# EAGLE design Heizstabsteuerung (EAGLE 9.6.2)
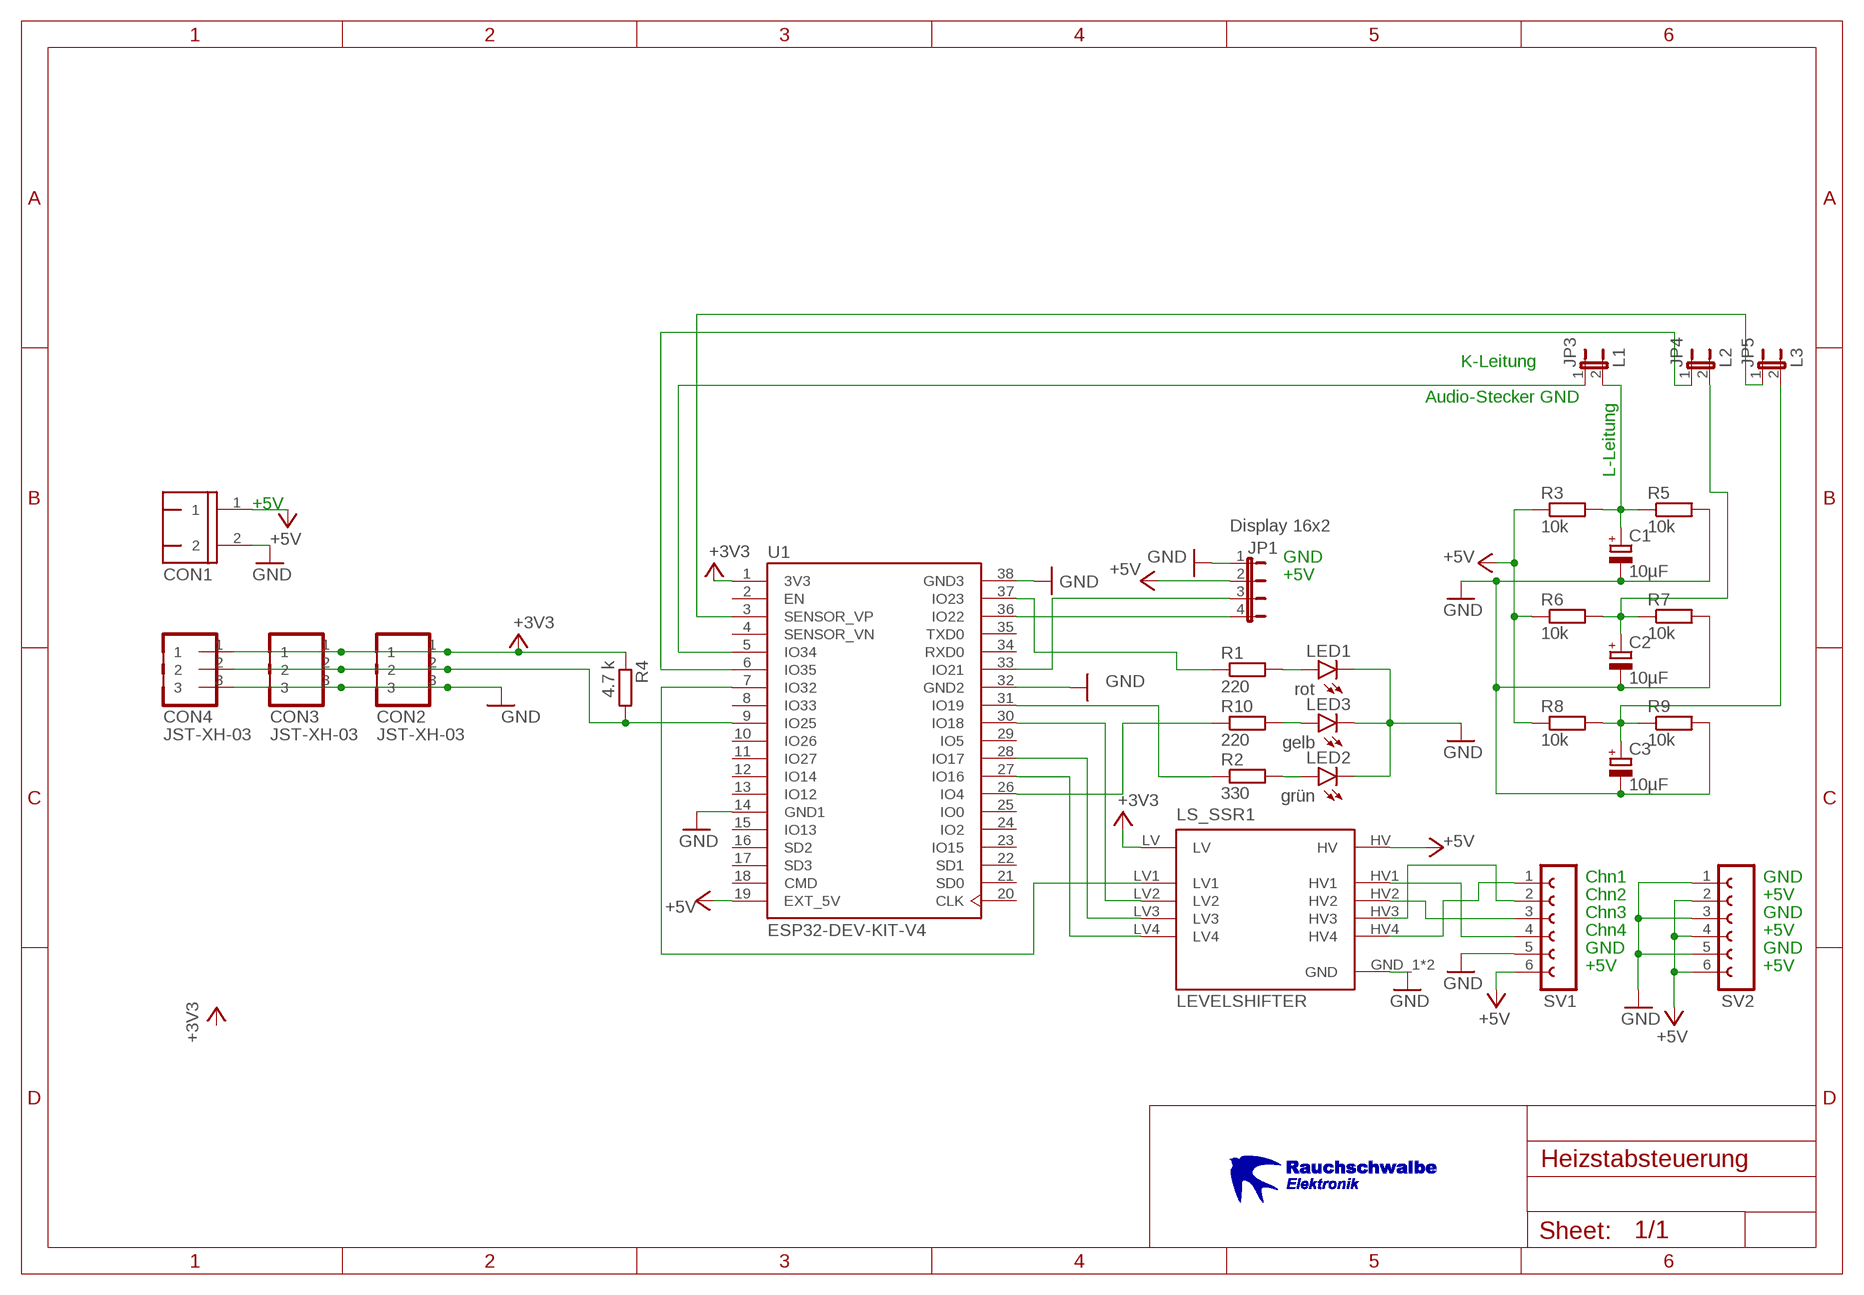
[diagram p0: schematic, sheet 1]

## Parts
C1  10µF  CPOL-EUE2.5-5  [E2,5-5]
C2  10µF  CPOL-EUE2.5-5  [E2,5-5]
C3  10µF  CPOL-EUE2.5-5  [E2,5-5]
CON1  WAGO-500-2  [WAGO-500-2]
CON2  JST-XH-03  [JST-XH-03]
CON3  JST-XH-03  [JST-XH-03]
CON4  JST-XH-03  [JST-XH-03]
JP1  Display 16x2  JP4E  [JP4]
JP3  L1  JP1E  [JP1]
JP4  L2  JP1E  [JP1]
JP5  L3  JP1E  [JP1]
LED1  rot  LED3MM  [LED3MM]
LED2  grün  LED3MM  [LED3MM]
LED3  gelb  LED3MM  [LED3MM]
LS_SSR1  LEVELSHIFTER  [LEVELSHIFTER]
R1  220  R_10MM0207/10  [0207/10]
R2  330  R_10MM0207/10  [0207/10]
R3  10k  R_10MM0207/10  [0207/10]
R4  4.7 k  R_10MM0207/10  [0207/10]
R5  10k  R_10MM0207/10  [0207/10]
R6  10k  R_10MM0207/10  [0207/10]
R7  10k  R_10MM0207/10  [0207/10]
R8  10k  R_10MM0207/10  [0207/10]
R9  10k  R_10MM0207/10  [0207/10]
R10  220  R_10MM0207/10  [0207/10]
SV1  FE06-1  [FE06]
SV2  FE06-1  [FE06]
U1  ESP32-DEV-KIT-V4  [ESP32-DEV-KIT-V4]
U$1  LOGO_RAUCHSCHWALBE  [LOGO_RAUCHSCHWALBE]

## Nets
+3V3 [Versorgung]: CON2.1 CON3.1 CON4.1 LS_SSR1.LV R4.1 U1.1(3V3)
+5V [Versorgung]: CON1.1 JP1.2 LS_SSR1.HV R3.1 R6.1 R8.1 SV1.6 SV2.2 SV2.4 SV2.6 U1.19(EXT_5V)
GND [Versorgung]: C1.- C2.- C3.- CON1.2 CON2.3 CON3.3 CON4.3 JP1.1 LED1.K(C) LED2.K(C) LED3.K(C) LS_SSR1.GND_1(GND) LS_SSR1.GND_2(GND) R5.2 R7.2 R9.2 SV1.5 SV2.1 SV2.3 SV2.5 U1.14(GND1) U1.32(GND2) U1.38(GND3)
N$1 [Data]: R1.1 U1.37(IO23)
N$2 [Data]: C1.+ JP3.2 R3.2 R5.1
N$3 [Data]: LED3.A R10.2
N$4 [Data]: JP1.3 U1.33(IO21)
N$5 [Data]: JP1.4 U1.36(IO22)
N$6 [Data]: R2.1 U1.31(IO19)
N$7 [Data]: LED1.A R1.2
N$8 [Data]: LED2.A R2.2
N$9 [Data]: LS_SSR1.HV4 SV1.1
N$10 [Data]: LS_SSR1.LV1 U1.7(IO32)
N$11 [Data]: CON2.2 CON3.2 CON4.2 R4.2 U1.9(IO25)
N$12 [Data]: JP3.1 U1.5(IO34)
N$14 [Data]: LS_SSR1.LV4 U1.27(IO16)
N$15 [Data]: LS_SSR1.LV3 U1.28(IO17)
N$16 [Data]: LS_SSR1.LV2 U1.30(IO18)
N$17 [Data]: R10.1 U1.26(IO4)
N$18 [Data]: LS_SSR1.HV1 SV1.4
N$19 [Data]: LS_SSR1.HV2 SV1.3
N$20 [Data]: LS_SSR1.HV3 SV1.2
N$21 [Data]: JP4.1 U1.6(IO35)
N$22 [Data]: JP5.1 U1.3(SENSOR_VP)
N$27 [Data]: C2.+ JP4.2 R6.2 R7.1
N$28 [Data]: C3.+ JP5.2 R8.2 R9.1
Unconnected: U1.2(EN) U1.4(SENSOR_VN) U1.8(IO33) U1.10(IO26) U1.11(IO27) U1.12(IO14) U1.13(IO12) U1.15(IO13) U1.16(SD2) U1.17(SD3) U1.18(CMD) U1.20(CLK) U1.21(SD0) U1.22(SD1) U1.23(IO15) U1.24(IO2) U1.25(IO0) U1.29(IO5) U1.34(RXD0) U1.35(TXD0)

## Notes on the sheet
- K-Leitung
- Audio-Stecker GND | L-Leitung
- +5V
- GND
- +5V
- Chn1 | GND
- Chn2 | +5V
- Chn3 | GND
- Chn4 | +5V
- GND | GND
- +5V | +5V

## Library data of the parts
C1-C3 = Heizstabsteuerung:CPOL-EU: POLARIZED CAPACITOR, European symbol; SPICEPREFIX: C
CON1 = Heizstabsteuerung:WAGO-500-2: WAGO SCREW CLAMP; MPN: 237-102; OC_FARNELL: unknown; OC_NEWARK: 70K9898
CON2-CON4 = Heizstabsteuerung:JST-XH-03
JP1 = jumper:JP4E: JUMPER
JP3-JP5 = jumper:JP1E: JUMPER
LED1-LED3 = Heizstabsteuerung:LED: LED OSRAM: - CHIPLED LG R971, LG N971, LY N971, LG Q971, LY Q971, LO R971, LY R971 LH N974, LH R974 LS Q976, LO Q976, LY Q976 LO Q996 - Hyper CHIPLED LW Q18S LB Q993, LB Q99A, LB R99A - SideLED LS A670, LO A670, LY A670, LG A670, LP A670 LB A673, LV A673, LT A673, LW A673 LH A674 LY A675 LS A676, LA A676, LO A676, LY A676, LW A676 LS A679, LY A679, LG A679 - Hyper Micro SIDELED® LS Y876, LA Y876, LO Y876, LY Y876 LT Y87S - SmartLED LW L88C, LW L88S LB L89C, LB L89S, LG L890 LS L89K, LO L89K, LY L89K LS L896, LA L896, LO L896, LY L896 - TOPLED LS T670, LO T670, LY T670, LG T670, LP T670 LSG T670, LSP T670, LSY T670, LOP T670, LYG T670 LG T671, LOG T671, LSG T671 LB T673, LV T673, LT T673, LW T673 LH T674 LS T676, LA T676, LO T676, LY T676, LB T676, LH T676, LSB T676, LW T676 LB T67C, LV T67C, LT T67C, LS T67K, LO T67K, LY T67K, LW E67C LS E67B, LA E67B, LO E67B, LY E67B, LB E67C, LV E67C, LT E67C LW T67C LS T679, LY T679, LG T679 LS T770, LO T770, LY T770, LG T770, LP T770 LB T773, LV T773, LT T773, LW T773 LH T774 LS E675, LA E675, LY E675, LS T675 LS T776, LA T776, LO T776, LY T776, LB T776 LHGB T686 LT T68C, LB T68C - Hyper Mini TOPLED® LB M676 - Mini TOPLED Santana® LG M470 LS M47K, LO M47K, LY M47K Source: http://www.osram.convergy.de LUXEON: - LUMILED® LXK2-PW12-R00, LXK2-PW12-S00, LXK2-PW14-U00, LXK2-PW14-V00 LXK2-PM12-R00, LXK2-PM12-S00, LXK2-PM14-U00 LXK2-PE12-Q00, LXK2-PE12-R00, LXK2-PE12-S00, LXK2-PE14-T00, LXK2-PE14-U00 LXK2-PB12-K00, LXK2-PB12-L00, LXK2-PB12-M00, LXK2-PB14-N00, LXK2-PB14-P00, LXK2-PB14-Q00 LXK2-PR12-L00, LXK2-PR12-M00, LXK2-PR14-Q00, LXK2-PR14-R00 LXK2-PD12-Q00, LXK2-PD12-R00, LXK2-PD12-S00 LXK2-PH12-R00, LXK2-PH12-S00 LXK2-PL12-P00, LXK2-PL12-Q00, LXK2-PL12-R00 Source: www.luxeon.com KINGBRIGHT: KA-3528ASYC Source: www.kingbright.com
LS_SSR1 = Heizstabsteuerung:LEVELSHIFTER: Logic Level Converter - Bi-Direc Check availability <https://pricing.snapeda.com/parts/BOB-12009/SparkFun/view-part?ref=eda>; AVAILABILITY: In Stock; DESCRIPTION: BSS138 Logic-Level Translator Interface Evaluation Board; MF: SparkFun; MP: BOB-12009; PACKAGE: None; PRICE: None; PURCHASE-URL: https://pricing.snapeda.com/search?q=BOB-12009&ref=eda
R1-R10 = Heizstabsteuerung:R_10MM: RESISTOR, European symbol; SPICEPREFIX: R
SV1 SV2 = Heizstabsteuerung:FE06-1: FEMALE HEADER; OC_FARNELL: unknown; OC_NEWARK: unknown
U1 = Heizstabsteuerung:ESP32-DEV-KIT-V4: ESP32-DEVKITC Check availability <https://pricing.snapeda.com/parts/ESP32-DEVKITC/Espressif%20Systems/view-part?ref=eda>; AVAILABILITY: In Stock; CHECK_PRICES: https://www.snapeda.com/parts/ESP32-DEVKITC/Espressif+Systems/view-part/?ref=eda; DESCRIPTION: ESP32-WROOM-32UE series Transceiver; 802.11 b/g/n (Wi-Fi, WiFi, WLAN), Bluetooth ® Smart Ready 4.x Dual Mode Evaluation Board; MF: Espressif Systems; MP: ESP32-DEVKITC; PACKAGE: None; PRICE: None; SNAPEDA_LINK: https://www.snapeda.com/parts/ESP32-DEVKITC/Espressif+Systems/view-part/?ref=snap
U$1 = Heizstabsteuerung:LOGO_RAUCHSCHWALBE

## Net classes
1 Versorgung: width 0.762 mm, drill 0.8 mm, clearance 0.508 mm
2 Data: width 0.406 mm, drill 0.6 mm, clearance 0.254 mm

## Board
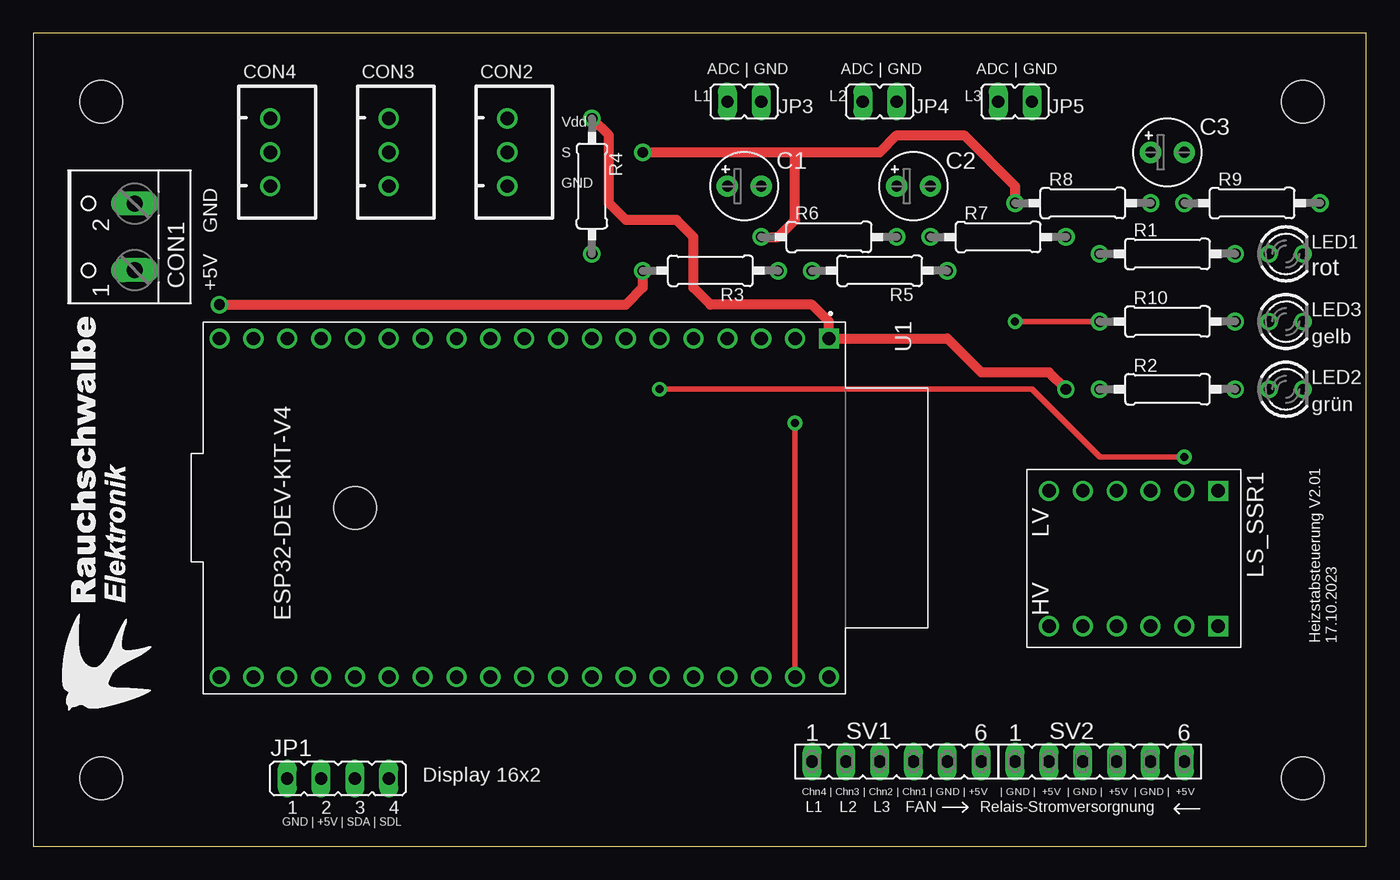
[diagram p1: board, top side]
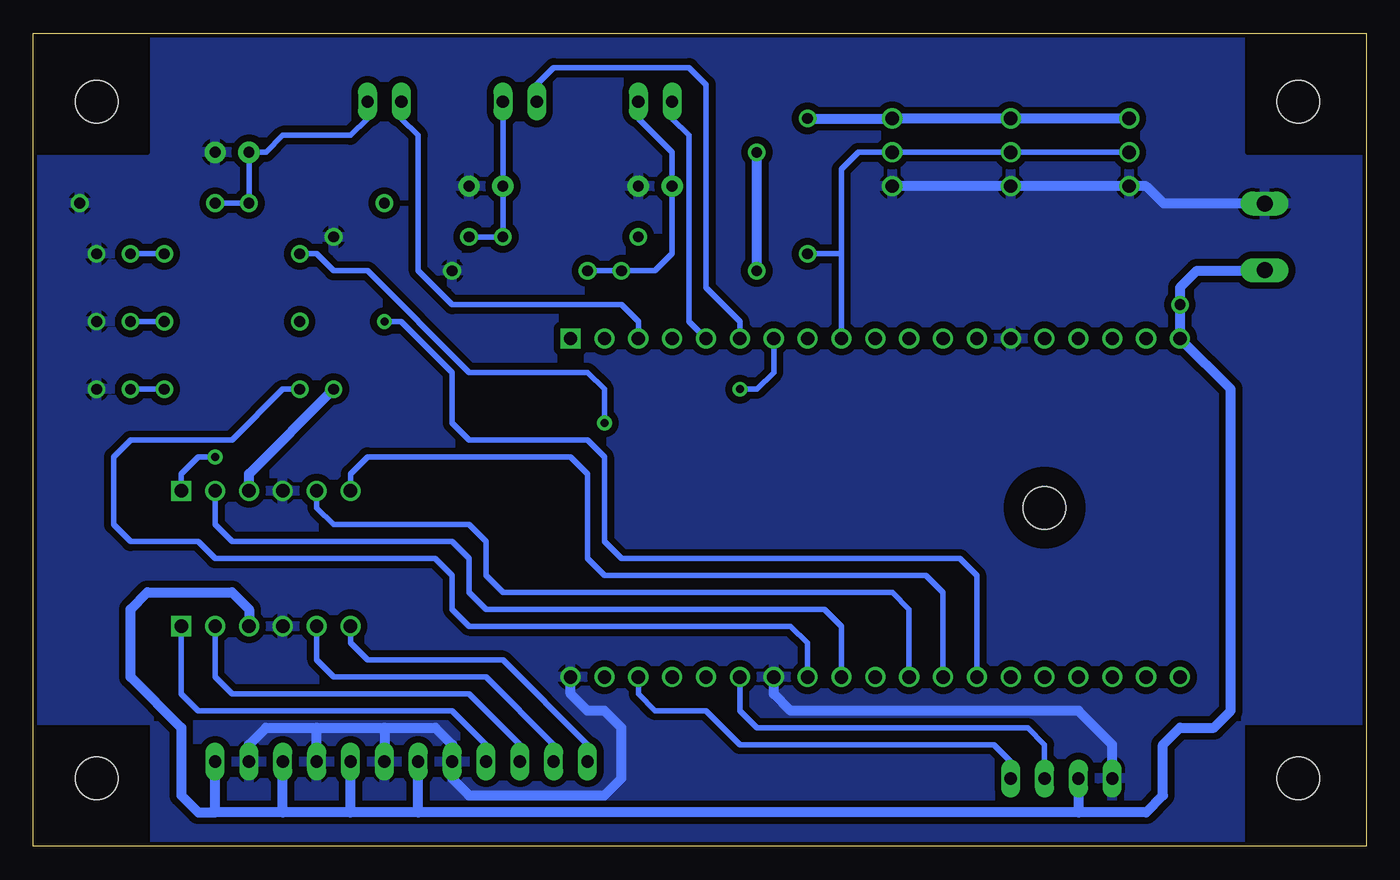
[diagram p2: board, bottom side, seen from below]

Size 100 x 61 mm. Coordinates in mm from the lower left corner, seen from the top.
Outline: 0,0 100,0 100,61 0,61 0,0
Copper layers (1*16): Top 0.035mm / dielectric 1.5mm / Bottom 0.035mm
Design rules "JLCPCB_DRC": minimum track width 5mil, minimum drill 0.3mm, track to track 5mil, track to pad 0.2mm, pad to pad 10mil, via to via 0.5mm, smd to smd 10mil, copper to edge 0.3mm, drill to drill 10mil, minimum pad ring 10mil, minimum via ring 10mil, stop-mask expansion 4mil, vias tented up to drill 0mil, thermal gap 10mil
Holes 3.2 mm at 5.08,55.88 95.25,55.88 95.25,5.08 5.08,5.08 24.13,25.4
bRestrict: area 21.3,22.6 to 27,28.2; 8 lines

### Footprints (pad centres in the part's own frame; a part is rotated, then mirrored left to right if it is on the bottom)
E2,5-5 = drill 0.813 pad 1.6: + -1.27,0; - 1.27,0
WAGO-500-2 = drill 1.2 long: 1 -2.5,-1.27; 2 2.5,-1.27
JST-XH-03 = drill 1: 1 -2.54,0; 2 0,0; 3 2.54,0
JP4 = drill 0.914 long: 1 -3.81,0; 2 -1.27,0; 3 1.27,0; 4 3.81,0
JP1 = drill 0.914 long: 1 0,-1.27; 2 0,1.27
LED3MM = drill 0.8: A -1.27,0; K 1.27,0
LEVELSHIFTER = drill 1: GND_1 5.08,-1.27; GND_2 -5.08,-1.27; HV 5.08,1.27; HV2 5.08,3.81; HV3 5.08,-3.81; HV4 5.08,-6.35; LV -5.08,1.27; LV2 -5.08,3.81; LV3 -5.08,-3.81; LV4 -5.08,-6.35 | drill 1 square: HV1 5.08,6.35; LV1 -5.08,6.35
0207/10 = drill 0.813: 1 -5.08,0; 2 5.08,0
FE06 = drill 0.914 long: 1 -6.35,0; 2 -3.81,0; 3 -1.27,0; 4 1.27,0; 5 3.81,0; 6 6.35,0
ESP32-DEV-KIT-V4 = drill 1 square: 1 -12.7,22.86 | drill 1: 2 -12.7,20.32; 3 -12.7,17.78; 4 -12.7,15.24; 5 -12.7,12.7; 6 -12.7,10.16; 7 -12.7,7.62; 8 -12.7,5.08; 9 -12.7,2.54; 10 -12.7,0; 11 -12.7,-2.54; 12 -12.7,-5.08; 13 -12.7,-7.62; 14 -12.7,-10.16; 15 -12.7,-12.7; 16 -12.7,-15.24; 17 -12.7,-17.78; 18 -12.7,-20.32; 19 -12.7,-22.86; 20 12.7,-22.86; 21 12.7,-20.32; 22 12.7,-17.78; 23 12.7,-15.24; 24 12.7,-12.7; 25 12.7,-10.16; 26 12.7,-7.62; 27 12.7,-5.08; 28 12.7,-2.54; 29 12.7,0; 30 12.7,2.54; 31 12.7,5.08; 32 12.7,7.62; 33 12.7,10.16; 34 12.7,12.7; 35 12.7,15.24; 36 12.7,17.78; 37 12.7,20.32; 38 12.7,22.86

### Placement (x,y rotation side)
C1  53.34,49.53 0 top
C2  66.04,49.53 0 top
C3  85.09,52.07 0 top
CON1  6.35,45.72 90 top
CON2  35.56,52.07 270 top
CON3  26.67,52.07 270 top
CON4  17.78,52.07 270 top
JP1  22.86,5.08 0 top
JP3  53.34,55.88 270 top
JP4  63.5,55.88 270 top
JP5  73.66,55.88 270 top
LED1  93.98,44.45 0 top
LED2  93.98,34.29 0 top
LED3  93.98,39.37 0 top
LS_SSR1  82.55,21.59 270 top
R1  85.09,44.45 0 top
R2  85.09,34.29 0 top
R3  50.8,43.18 0 top
R4  41.91,49.53 270 top
R5  63.5,43.18 0 top
R6  59.69,45.72 0 top
R7  72.39,45.72 0 top
R8  78.74,48.26 0 top
R9  91.44,48.26 0 top
R10  85.09,39.37 0 top
SV1  64.77,6.35 0 top
SV2  80.01,6.35 0 top
U1  36.83,25.4 270 top
U$1  8.89,10.16 90 top

### Tracks (layer width: path | path; a pad name or v marks a point on that pad's centre or on a via)
+3V3  (via drill 0.8)
  Top 0.762: v77.47,34.29 76.2,35.56 71.12,35.56 68.58,38.1 U1.1 59.69,39.37 58.42,40.64 50.8,40.64 49.53,41.91 49.53,45.72 48.26,46.99 44.45,46.99 43.18,48.26 43.18,53.34 R4.1
  Bottom 0.762: CON4.1 CON3.1 CON2.1 R4.1 | LS_SSR1.LV 83.82,27.94 v77.47,34.29
+5V  (via drill 0.8)
  Top 0.762: v13.97,40.64 44.45,40.64 45.72,41.91 R3.1 | v45.72,52.07 57.15,52.07 | 57.15,52.07 63.5,52.07 64.77,53.34 69.85,53.34 73.66,49.53 R8.1 | R6.1 55.88,45.72 57.15,46.99 57.15,52.07
  Bottom 0.762: CON1.1 7.66,43.18 12.7,43.18 13.97,41.91 v13.97,40.64 U1.19 10.16,34.29 10.16,10.16 11.43,8.89 13.97,8.89 15.24,7.62 15.24,3.81 16.51,2.54 21.59,2.54 | JP1.2 21.59,2.54 | 21.59,2.54 71.12,2.54 | 71.12,2.54 SV1.6 | 71.12,2.54 76.2,2.54 | 76.2,2.54 SV2.2 | 76.2,2.54 81.28,2.54 | 81.28,2.54 SV2.4 | 81.28,2.54 86.36,2.54 | 86.36,2.54 SV2.6 | LS_SSR1.HV 83.82,17.78 85.09,19.05 91.44,19.05 92.71,17.78 92.71,12.7 88.9,8.89 88.9,3.81 87.63,2.54 86.36,2.54 | R3.1 v45.72,52.07
GND
  Bottom 0.762: CON1.2 15.2,48.22 16.51,49.53 CON4.3 CON3.3 CON2.3 | JP1.1 19.05,7.62 21.59,10.16 43.18,10.16 44.45,11.43 U1.32 | SV2.5 83.82,7.62 82.55,8.89 78.74,8.89 | SV2.3 78.74,8.89 | 78.74,8.89 73.66,8.89 | 73.66,8.89 SV2.1 | 73.66,8.89 69.85,8.89 68.58,7.62 SV1.5 68.58,5.08 67.31,3.81 57.15,3.81 55.88,5.08 55.88,8.89 57.15,10.16 58.42,10.16 59.69,11.43 U1.38
  pour Bottom: -1.27,63.5 102.87,63.5 102.87,-2.54 -1.27,-2.54
N$1  (via drill 0.6)
  Top 0.406: U1.37 v57.15,31.75
  Bottom 0.406: v57.15,31.75 57.15,34.29 58.42,35.56 67.31,35.56 74.93,43.18 77.47,43.18 78.74,44.45 R1.1
N$2
  Bottom 0.406: R5.1 R3.2 53.34,43.18 52.07,44.45 C1.+ 52.07,52.07 54.61,54.61 JP3.2
N$3
  Bottom 0.406: R10.2 LED3.A
N$4
  Bottom 0.406: JP1.3 24.13,7.62 25.4,8.89 45.72,8.89 46.99,10.16 U1.33
N$5
  Bottom 0.406: JP1.4 26.67,6.35 27.94,7.62 46.99,7.62 49.53,10.16 53.34,10.16 54.61,11.43 U1.36
N$6
  Bottom 0.406: R2.1 81.28,34.29 85.09,30.48 92.71,30.48 93.98,29.21 93.98,24.13 92.71,22.86 87.63,22.86 86.36,21.59 69.85,21.59 68.58,20.32 68.58,17.78 67.31,16.51 43.18,16.51 41.91,15.24 U1.31
N$7
  Bottom 0.406: R1.2 LED1.A
N$8
  Bottom 0.406: R2.2 LED2.A
N$9
  Bottom 0.406: SV1.1 58.42,7.62 64.77,13.97 74.93,13.97 76.2,15.24 LS_SSR1.HV4
N$10  (via drill 0.6)
  Top 0.406: v86.36,29.21 80.01,29.21 74.93,34.29 v46.99,34.29
  Bottom 0.406: LS_SSR1.LV1 88.9,27.94 87.63,29.21 v86.36,29.21 | v46.99,34.29 45.72,34.29 44.45,35.56 U1.7
N$11
  Bottom 0.406: CON4.2 CON3.2 CON2.2 38.1,52.07 39.37,50.8 39.37,44.45 | U1.9 39.37,44.45 | R4.2 39.37,44.45
N$12
  Bottom 0.406: U1.5 50.8,39.37 50.8,53.34 52.07,54.61 JP3.1
N$14
  Bottom 0.406: LS_SSR1.LV4 76.2,27.94 74.93,29.21 59.69,29.21 58.42,27.94 58.42,21.59 57.15,20.32 33.02,20.32 31.75,19.05 U1.27
N$15
  Bottom 0.406: LS_SSR1.LV3 78.74,25.4 77.47,24.13 67.31,24.13 66.04,22.86 66.04,20.32 64.77,19.05 35.56,19.05 34.29,17.78 U1.28
N$16
  Bottom 0.406: LS_SSR1.LV2 86.36,24.13 85.09,22.86 68.58,22.86 67.31,21.59 67.31,19.05 66.04,17.78 40.64,17.78 39.37,16.51 U1.30
N$17  (via drill 0.6)
  Top 0.406: R10.1 v73.66,39.37
  Bottom 0.406: v73.66,39.37 72.39,39.37 68.58,35.56 68.58,31.75 67.31,30.48 58.42,30.48 57.15,29.21 57.15,22.86 55.88,21.59 30.48,21.59 29.21,20.32 U1.26
N$18
  Bottom 0.406: SV1.4 66.04,7.62 68.58,10.16 87.63,10.16 88.9,11.43 LS_SSR1.HV1
N$19
  Bottom 0.406: SV1.3 63.5,7.62 67.31,11.43 85.09,11.43 86.36,12.7 LS_SSR1.HV2
N$20
  Bottom 0.406: SV1.2 60.96,7.62 66.04,12.7 77.47,12.7 78.74,13.97 LS_SSR1.HV3
N$21
  Bottom 0.406: U1.6 46.99,39.37 49.53,41.91 49.53,57.15 50.8,58.42 60.96,58.42 62.23,57.15 JP4.1
N$22
  Bottom 0.406: U1.3 54.61,39.37 55.88,40.64 68.58,40.64 71.12,43.18 71.12,53.34 72.39,54.61 JP5.1
N$27
  Bottom 0.406: R7.1 R6.2 C2.+ JP4.2
N$28
  Bottom 0.406: JP5.2 74.93,54.61 76.2,53.34 81.28,53.34 82.55,52.07 C3.+ R8.2 R9.1

### Text on the board
tNames: ADC | GND | ADC | GND | ADC | GND | L1 | L2 | L3 | GND | Vdd / / S / / GND | +5V | Heizstabsteuerung V2.01 / 17.10.2023 | Chn4 | Chn3 | Chn2 | Chn1 | GND | +5V | | GND | +5V | GND | +5V | GND | +5V | L1 | L2 | L3 | FAN | Relais-Stromversorgnung | GND | +5V | SDA | SDL